# Altium schematic sheet SD card.SchDoc: MICRO SD 3.0 Card
size A4; DocumentNumber: MB1246; Revision: B.1; SheetNumber: 12; SheetTotal: 17; Project: STM32H7xxI-EVAL
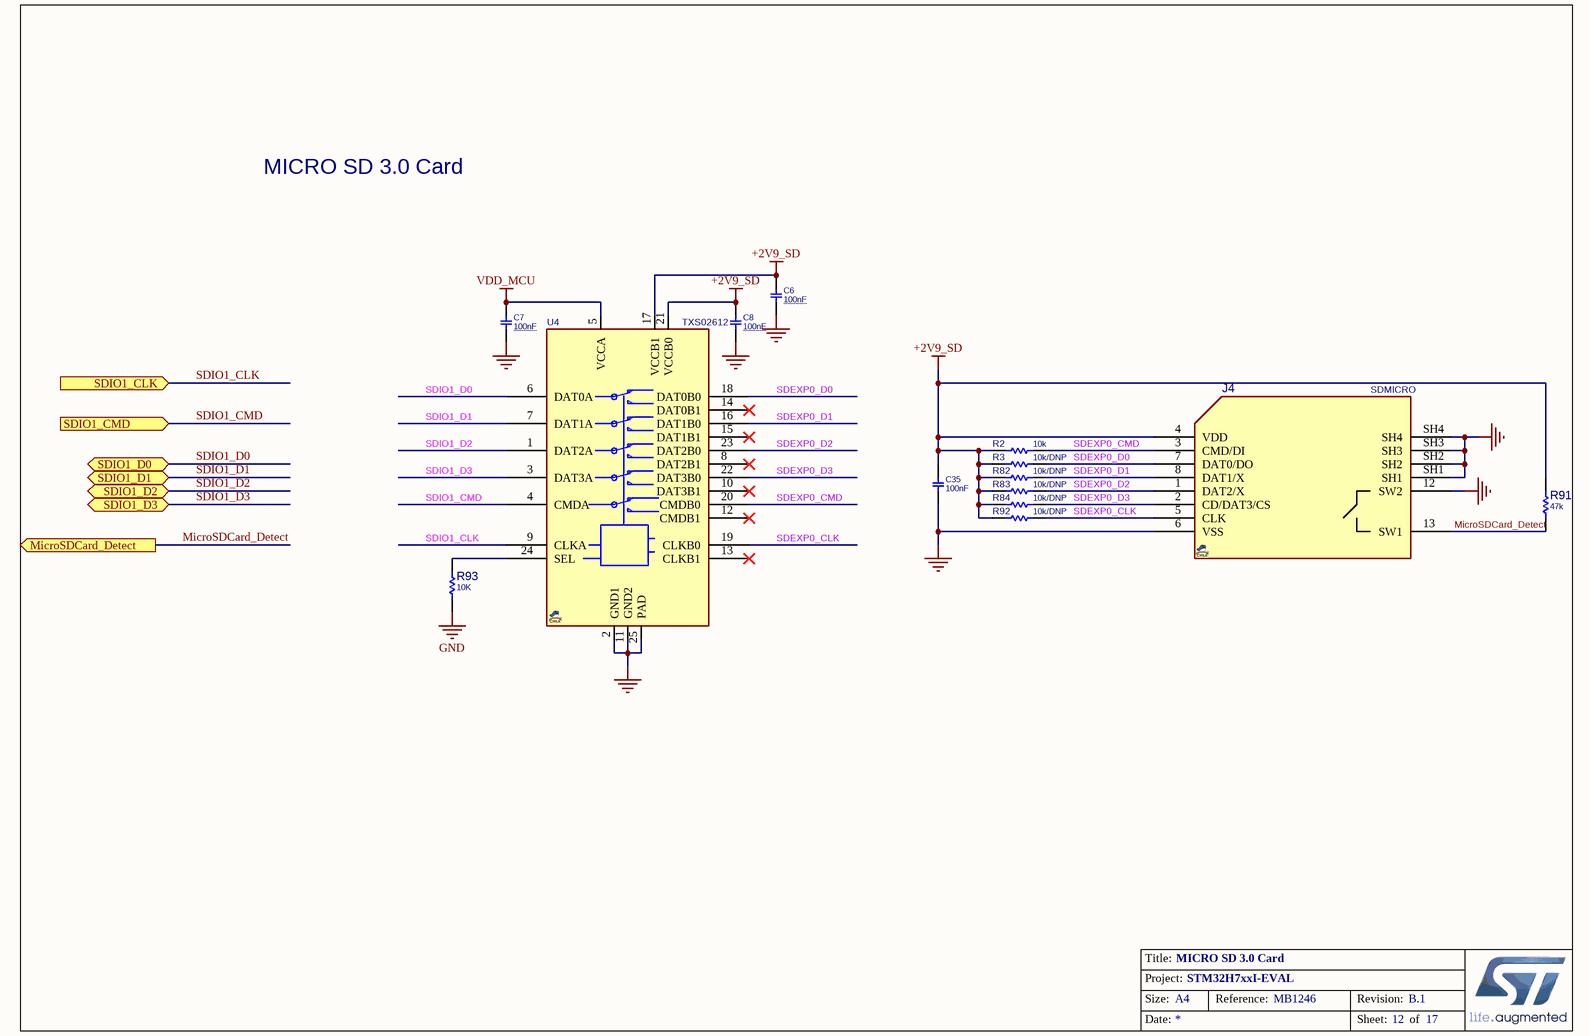
[diagram p0: SD card.SchDoc]

## Parts
C6  100nF  [C0603E]
C7  100nF  [C0603E]
C8  100nF  [C0603E]
C35  100nF  [C0603E]
J4  SDMICRO  [SDMICRO_MOLEX104031]
R2  10k  [R0603E]
R3  10k/DNP  [R0603E]
R82  10k/DNP  [R0603E]
R83  10k/DNP  [R0603E]
R84  10k/DNP  [R0603E]
R91  47k  [R0603E]
R92  10k/DNP  [R0603E]
R93  10K  [R0603E]
U4  TXS02612  [QFN50_24T]

## Ports
MicroSDCard_Detect (out), SDIO1_CLK (in), SDIO1_CMD (in), SDIO1_D0 (bidir), SDIO1_D1 (bidir), SDIO1_D2 (bidir), SDIO1_D3 (bidir)

## Nets
+2V9_SD: C6.1 C8.1 C35.1 J4.4(VDD) R2.1 R3.1 R82.1 R83.1 R84.1 R91.2 R92.1 U4.17(VCCB1) U4.21(VCCB0)
GND: C6.2 C7.2 C8.2 C35.2 J4.6(VSS) J4.12(SW2) J4.SH1 J4.SH2 J4.SH3 J4.SH4 R93.1 U4.2(GND1) U4.11(GND2) U4.25(PAD)
VDD_MCU: C7.1 U4.5(VCCA)
MicroSDCard_Detect: J4.13(SW1) R91.1 ; port MicroSDCard_Detect
SDEXP0_CLK: J4.5(CLK) R92.2 U4.19(CLKB0)
SDEXP0_CMD: J4.3(CMD/DI) R2.2 U4.20(CMDB0)
SDEXP0_D0: J4.7(DAT0/DO) R3.2 U4.18(DAT0B0)
SDEXP0_D1: J4.8(DAT1/X) R82.2 U4.16(DAT1B0)
SDEXP0_D2: J4.1(DAT2/X) R83.2 U4.23(DAT2B0)
SDEXP0_D3: J4.2(CD/DAT3/CS) R84.2 U4.22(DAT3B0)
SDIO1_CLK: U4.9(CLKA) ; port SDIO1_CLK
SDIO1_CMD: U4.4(CMDA) ; port SDIO1_CMD
SDIO1_D0: U4.6(DAT0A) ; port SDIO1_D0
SDIO1_D1: U4.7(DAT1A) ; port SDIO1_D1
SDIO1_D2: U4.1(DAT2A) ; port SDIO1_D2
SDIO1_D3: U4.3(DAT3A) ; port SDIO1_D3
NetR93_2: R93.2 U4.24(SEL)

Not connected (* = marked no-connect by the designer): U4 8(DAT2B1)* 10(DAT3B1)* 12(CMDB1)* 13(CLKB1)* 14(DAT0B1)* 15(DAT1B1)*

## Notes on the sheet
- MICRO SD 3.0 Card
- Title:
- Project:
- Size:
- Date:
- A4
- Reference:
- Sheet:
- Revision:
- of

## Library data of the parts
C6-C8 = CAP_SMD_MLCC: CAP, MLCC; DESC: CAP, MLCC, 1nF, 50V, C0G, 10%, 0402; MANF_P#: MANF_PART#; MANF: Murata; PARAM2: 50V; PARAM: -; PRICE: 100= 1$; ASSEMBLY: ASSEMBLY; VALUE: 100nF
C35 = CAP_SMD_MLCC_100n50TDK: CAP, MLCC; PARAM: X5R, 10%; MANF_P#: GRM155R61E104; MANF: Murata; PARAM2: 25v; ASSEMBLY: ASSEMBLY; PRICE: 10,000:$0.006; VALUE: 100nF
J4 = SOCKET_SDMICRO_MOLEX104031: CONN MICRO SD R/A PUSHin-PULLout SMD; MANF: Molex; MANF_P#: 104031-0811; PRICE: 2$; VALUE: SDMICRO
R2 R3 R82-R84 R91-R93 = RES_SMD: RESISTOR, SMD; PARAM: 0.063W; DESC: DESCRIPTION; DIST#: MOUSER; PARAM2: 1%; MANF_P#: -; MANF: -; ASSEMBLY: ASSEMBLY; PRICE: 100= 0.3$
  R2: VALUE: 10k
  R3 R82-R84 R92: VALUE: 10k/DNP
  R91: VALUE: 47k
  R93: VALUE: 10K
U4 = TXS02612_QFN24: I/O Expander, SDIO; MANF: Texas Instruments; MANF_P#: TXS02612RTWR; PARAM2: 1.1~3.6V; VALUE: TXS02612